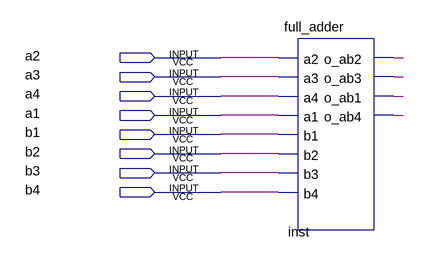
[diagram p0: schematic sheet]
// Quartus schematic bcd_with_adder.bdf as structural Verilog: 1 symbols, 8 pins
module bcd_with_adder (
  input  a2,
  input  a3,
  input  a4,
  input  a1,
  input  b1,
  input  b2,
  input  b3,
  input  b4
);

  wire inst_o_ab1, inst_o_ab2, inst_o_ab3, inst_o_ab4;

  full_adder inst (
    .a2(a2), .a3(a3), .a4(a4), .a1(a1), .b1(b1), .b2(b2), .b3(b3), .b4(b4), .o_ab2(inst_o_ab2),
    .o_ab3(inst_o_ab3), .o_ab1(inst_o_ab1), .o_ab4(inst_o_ab4));
endmodule
